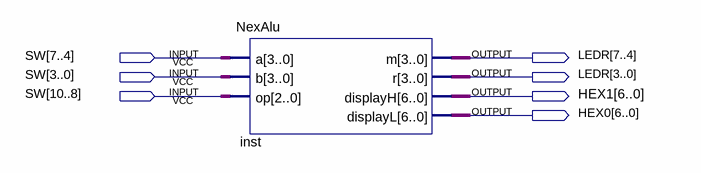
[diagram p0: schematic sheet]
// Quartus schematic NexAluDemo.bdf as structural Verilog: 1 symbols, 7 pins
module NexAluDemo (
  input  [10:0] SW,
  output [7:0] LEDR,
  output [6:0] HEX1,
  output [6:0] HEX0
);

  NexAlu inst (.a(SW[7:4]), .b(SW[3:0]), .op(SW[10:8]), .m(LEDR[7:4]), .r(LEDR[3:0]), .displayH(HEX1), .displayL(HEX0));
endmodule
